# EAGLE schematic BLDC_logic_v1 (EAGLE 9.6.2)
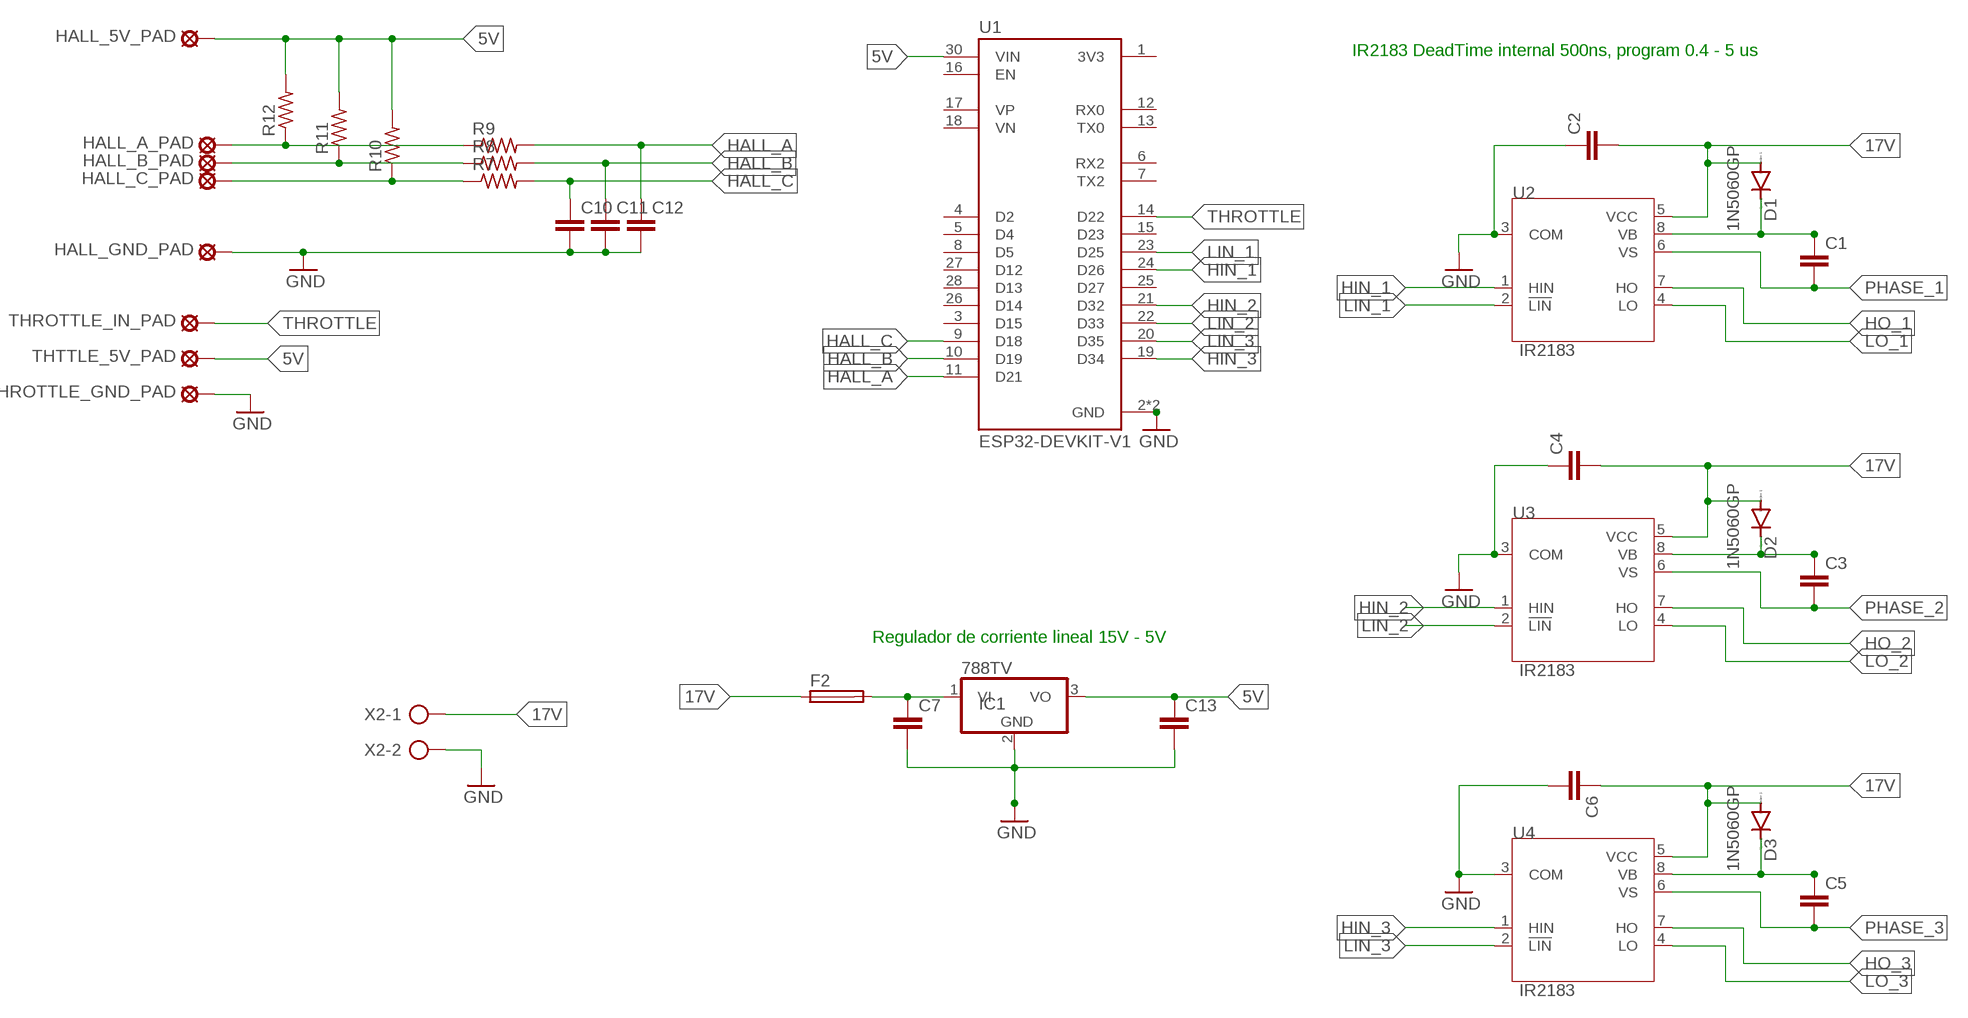
[diagram p0: schematic, sheet 1]

## Parts
C1  C-EU025-030X050  [C025-030X050]
C2  C-EU025-030X050  [C025-030X050]
C3  C-EU025-030X050  [C025-030X050]
C4  C-EU025-030X050  [C025-030X050]
C5  C-EU025-030X050  [C025-030X050]
C6  C-EU025-030X050  [C025-030X050]
C7  C-EU025-030X050  [C025-030X050]
C10  C-EU025-030X050  [C025-030X050]
C11  C-EU025-030X050  [C025-030X050]
C12  C-EU025-030X050  [C025-030X050]
C13  C-EU025-030X050  [C025-030X050]
D1  1N5060GP  [DO15-12]
D2  1N5060GP  [DO15-12]
D3  1N5060GP  [DO15-12]
F2  SH22,5  [SH22,5]
HALL_5V_PAD  MCS08  [MCS08]
HALL_A_PAD  MCS08  [MCS08]
HALL_B_PAD  MCS08  [MCS08]
HALL_C_PAD  MCS08  [MCS08]
HALL_GND_PAD  MCS08  [MCS08]
IC1  788TV  [TO220V]
R7  R-US_0204/7  [0204/7]
R8  R-US_0204/7  [0204/7]
R9  R-US_0204/7  [0204/7]
R10  R-US_0204/7  [0204/7]
R11  R-US_0204/7  [0204/7]
R12  R-US_0204/7  [0204/7]
THROTTLE_GND_PAD  MCS08  [MCS08]
THROTTLE_IN_PAD  MCS08  [MCS08]
THTTLE_5V_PAD  MCS08  [MCS08]
U1  ESP32-DEVKIT-V1  [MODULE_ESP32_DEVKIT_V1]
U2  IR2183  [DIP762W45P254L1092H533Q8]
U3  IR2183  [DIP762W45P254L1092H533Q8]
U4  IR2183  [DIP762W45P254L1092H533Q8]
X2  AK500/2-H  [AK500/2-H]

## Nets
5V: C13.1 HALL_5V_PAD.MP IC1.3(VO) R10.2 R11.2 R12.2 THTTLE_5V_PAD.MP U1.30(VIN)
17V: C2.2 C4.2 C6.1 D1.A D2.A D3.A F2.1 U2.5(VCC) U3.5(VCC) U4.5(VCC) X2.1
GND: C2.1 C4.1 C6.2 C7.2 C10.2 C11.2 C12.2 C13.2 HALL_GND_PAD.MP IC1.2(GND) THROTTLE_GND_PAD.MP U1.2(GND) U1.29(GND) U2.3(COM) U3.3(COM) U4.3(COM) X2.2
HALL_A: C12.1 R9.2 U1.11(D21)
HALL_B: C11.1 R8.2 U1.10(D19)
HALL_C: C10.1 R7.2 U1.9(D18)
HIN_1: U1.24(D26) U2.1(HIN)
HIN_2: U1.21(D32) U3.1(HIN)
HIN_3: U1.19(D34) U4.1(HIN)
HO_1: U2.7(HO)
HO_2: U3.7(HO)
HO_3: U4.7(HO)
LIN_1: U1.23(D25) U2.2(!LIN)
LIN_2: U1.22(D33) U3.2(!LIN)
LIN_3: U1.20(D35) U4.2(!LIN)
LO_1: U2.4(LO)
LO_2: U3.4(LO)
LO_3: U4.4(LO)
N$1: C3.1 D2.C U3.8(VB)
N$2: C5.1 D3.C U4.8(VB)
N$3: C1.1 D1.C U2.8(VB)
N$13: C7.1 F2.2 IC1.1(VI)
N$14: HALL_A_PAD.MP R9.1 R12.1
N$15: HALL_B_PAD.MP R8.1 R11.1
N$16: HALL_C_PAD.MP R7.1 R10.1
PHASE_1: C1.2 U2.6(VS)
PHASE_2: C3.2 U3.6(VS)
PHASE_3: C5.2 U4.6(VS)
THROTTLE: THROTTLE_IN_PAD.MP U1.14(D22)
Unconnected: U1.1(3V3) U1.3(D15) U1.4(D2) U1.5(D4) U1.6(RX2) U1.7(TX2) U1.8(D5) U1.12(RX0) U1.13(TX0) U1.15(D23) U1.16(EN) U1.17(VP) U1.18(VN) U1.25(D27) U1.26(D14) U1.27(D12) U1.28(D13)

## Notes on the sheet
- IR2183 DeadTime internal 500ns, program 0.4 - 5 us
- Regulador de corriente lineal 15V - 5V

## Library data of the parts
C1-C7 C10-C13 = rcl:C-EU: CAPACITOR, European symbol; SPICEPREFIX: C
D1-D3 = diode:1N5060GP: DIODE controlled avalanche rectifier
F2 = fuse:SH22,5: FUSE HOLDER grid 22,5 mm, OGN0031 8201, Schurter (Buerklin); MF: SCHURTER; MPN: 0031.8201; OC_FARNELL: 1162740; OC_NEWARK: 96F8317
HALL_5V_PAD HALL_A_PAD HALL_B_PAD HALL_C_PAD HALL_GND_PAD THROTTLE_GND_PAD THROTTLE_IN_PAD THTTLE_5V_PAD = solpad:MCS08: SOLDER PAD MC S0,8, drill 1.2 mm, distributor Buerklin, 08F130
IC1 = linear:78*: Positive VOLTAGE REGULATOR Source: http://cache.national.com/ds/LM/LM78L05.pdf http://www.fairchildsemi.com/ds/LM/LM7805.pdf
R7-R12 = rcl:R-US_: RESISTOR, American symbol; SPICEPREFIX: R
U1 = ESP32-DEVKIT-V1:ESP32-DEVKIT-V1: Dual core, Wi-Fi: 2.4 GHz up to 150 Mbits/s,BLE (Bluetooth Low Energy) and legacy Bluetooth, 32 bits, Up to 240 MHz Check availability <https://pricing.snapeda.com/parts/ESP32-DEVKIT-V1/Do%20it/view-part?ref=eda>; AVAILABILITY: Not in stock; DESCRIPTION: Dual core, Wi-Fi: 2.4 GHz up to 150 Mbits/s,BLE (Bluetooth Low Energy) and legacy Bluetooth, 32 bits, Up to 240 MHz; MF: Do it; MP: ESP32-DEVKIT-V1; PACKAGE: None; PRICE: None
U2-U4 = IR2183:IR2183: MOSFET DRVR 600V 2.3A 2-OUT Hi/Lo Side Half Brdg Inv/Non-Inv 8-Pin PDIP Check availability <https://pricing.snapeda.com/parts/IR2183/Infineon/view-part?ref=eda>; AVAILABILITY: In Stock; DESCRIPTION: Half-Bridge Gate Driver IC Inverting, Non-Inverting 14-SOIC; MF: Infineon; MP: IR2183; PACKAGE: DIP-8 International Rectifier; PRICE: None; PURCHASE-URL: https://pricing.snapeda.com/search/part/IR2183/?ref=eda
X2 = con-ptr500:AK500/2-H: CONNECTOR Aug. 2004 / PTR Meßtechnik: Die Bezeichnung der Serie AK505 wurde geändert. Es handelt sich hierbei um AK500 in horizontaler Ausführung.; OC_FARNELL: unknown; OC_NEWARK: unknown

## Module HOLE
Ports: 

### Library data of the parts

## Net classes
0 default: clearance 0.205 mm